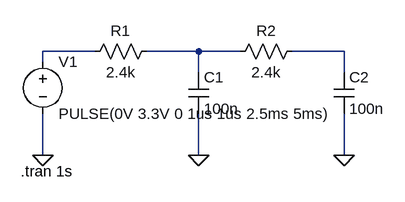
[diagram p0: schematic Draft1.asc]
Draft1.asc, the LTspice schematic file:
Version 4
SHEET 1 880 680
WIRE 96 128 16 128
WIRE 256 128 176 128
WIRE 320 128 256 128
WIRE 480 128 400 128
WIRE 16 144 16 128
WIRE 256 160 256 128
WIRE 480 160 480 128
WIRE 16 288 16 224
WIRE 256 288 256 224
WIRE 480 288 480 224
FLAG 256 288 0
FLAG 16 288 0
FLAG 480 288 0
SYMBOL res 192 112 R90
WINDOW 0 0 56 VBottom 2
WINDOW 3 32 56 VTop 2
SYMATTR InstName R1
SYMATTR Value 2.4k
SYMBOL cap 240 160 R0
SYMATTR InstName C1
SYMATTR Value 100n
SYMBOL voltage 16 128 R0
WINDOW 123 0 0 Left 2
WINDOW 39 0 0 Left 2
SYMATTR InstName V1
SYMATTR Value PULSE(0V 3.3V 0 1us 1us 2.5ms 5ms)
SYMBOL res 416 112 R90
WINDOW 0 0 56 VBottom 2
WINDOW 3 32 56 VTop 2
SYMATTR InstName R2
SYMATTR Value 2.4k
SYMBOL cap 464 160 R0
SYMATTR InstName C2
SYMATTR Value 100n
TEXT -18 312 Left 2 !.tran 1s

The netlist it stands for:
* Draft1.asc
R1 N002 N001 2.4k
C1 N002 0 100n
V1 N001 0 PULSE(0V 3.3V 0 1us 1us 2.5ms 5ms)
R2 N003 N002 2.4k
C2 N003 0 100n
.tran 1s
.backanno
.end